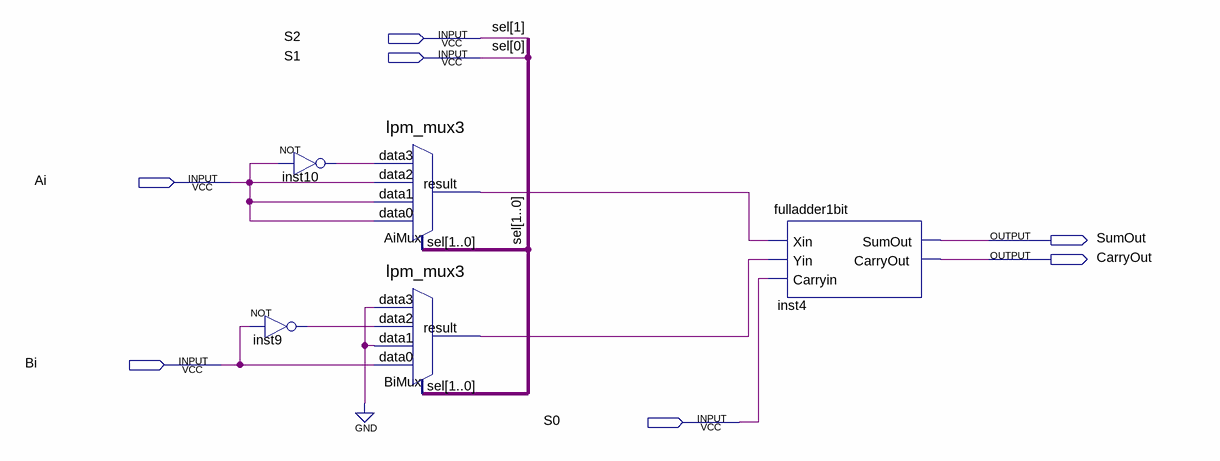
[diagram p0: schematic sheet]
// Quartus schematic arithcircuit1bit.bdf as structural Verilog: 5 symbols, 7 pins
module arithcircuit1bit (
  input  S2,
  input  S1,
  input  Ai,
  input  Bi,
  input  S0,
  output SumOut,
  output CarryOut
);

  wire AiMux_result, BiMux_result, inst9_out, inst10_out;

  not inst9 (inst9_out, Bi);
  not inst10 (inst10_out, Ai);
  lpm_mux3 AiMux (.data3(inst10_out), .data2(Ai), .data1(Ai), .data0(Ai), .sel({S2, S1}), .result(AiMux_result));
  lpm_mux3 BiMux (.data3(1'b0), .data2(inst9_out), .data1(1'b0), .data0(Bi), .sel({S2, S1}), .result(BiMux_result));
  fulladder1bit inst4 (.Xin(AiMux_result), .Yin(BiMux_result), .Carryin(S0), .SumOut(SumOut), .CarryOut(CarryOut));

  // Other names for the same wires on the sheet: sel[1:0] = {S2, S1}
endmodule
